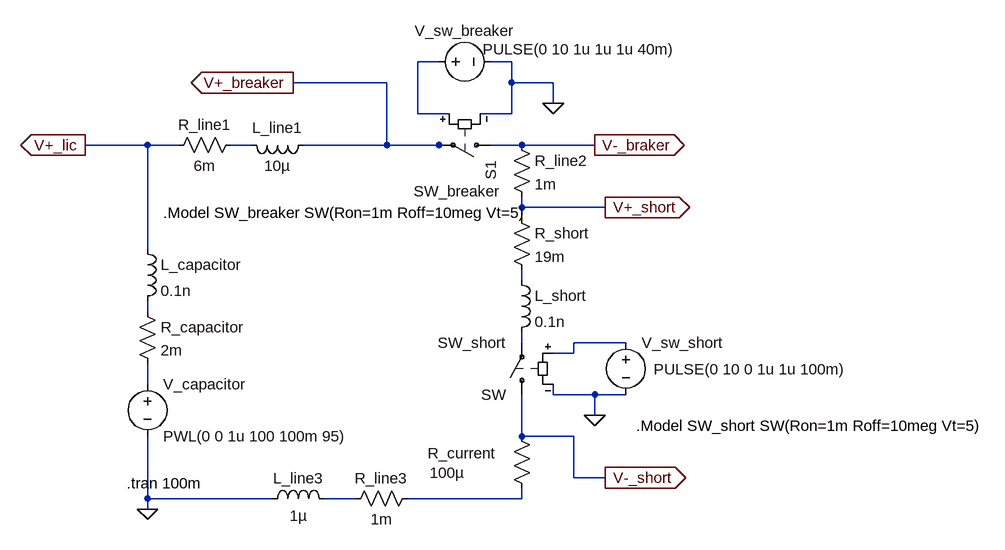
[diagram p0: schematic external-short-circuit-test_v1.asc]
external-short-circuit-test_v1.asc, the LTspice schematic file:
Version 4
SHEET 1 1392 680
WIRE 528 -240 496 -240
WIRE 640 -240 608 -240
WIRE 448 -208 304 -208
WIRE 640 -208 640 -240
WIRE 704 -208 640 -208
WIRE 704 -176 704 -208
WIRE 496 -160 496 -240
WIRE 544 -160 496 -160
WIRE 640 -160 640 -208
WIRE 640 -160 592 -160
WIRE 80 -112 -16 -112
WIRE 128 -112 80 -112
WIRE 240 -112 208 -112
WIRE 448 -112 448 -208
WIRE 448 -112 320 -112
WIRE 528 -112 448 -112
WIRE 544 -112 528 -112
WIRE 656 -112 608 -112
WIRE 768 -112 656 -112
WIRE 656 -16 656 -32
WIRE 784 -16 656 -16
WIRE 656 0 656 -16
WIRE 80 48 80 -112
WIRE 656 96 656 80
WIRE 80 144 80 128
WIRE 656 192 656 176
WIRE 816 192 736 192
WIRE 736 208 736 192
WIRE 736 208 704 208
WIRE 80 256 80 224
WIRE 704 272 704 256
WIRE 768 272 704 272
WIRE 816 272 768 272
WIRE 768 304 768 272
WIRE 656 336 656 272
WIRE 736 336 656 336
WIRE 736 400 736 336
WIRE 784 400 736 400
WIRE 80 432 80 336
WIRE 272 432 80 432
WIRE 400 432 352 432
WIRE 656 432 656 416
WIRE 656 432 480 432
WIRE 80 448 80 432
FLAG 80 448 0
FLAG 768 304 0
FLAG -16 -112 V+_lic
IOPIN -16 -112 Out
FLAG 784 -16 V+_short
IOPIN 784 -16 Out
FLAG 304 -208 V+_breaker
IOPIN 304 -208 Out
FLAG 768 -112 V-_braker
IOPIN 768 -112 Out
FLAG 784 400 V-_short
IOPIN 784 400 Out
FLAG 704 -176 0
SYMBOL res 64 128 R0
SYMATTR InstName R_capacitor
SYMATTR Value 2m
SYMBOL ind 64 32 R0
SYMATTR InstName L_capacitor
SYMATTR Value 0.1n
SYMBOL res 224 -128 R90
WINDOW 0 0 56 VBottom 2
WINDOW 3 32 56 VTop 2
SYMATTR InstName R_line1
SYMATTR Value 6m
SYMBOL ind 336 -128 R90
WINDOW 0 5 56 VBottom 2
WINDOW 3 32 56 VTop 2
SYMATTR InstName L_line1
SYMATTR Value 10µ
SYMBOL res 640 -128 R0
SYMATTR InstName R_line2
SYMATTR Value 1m
SYMBOL res 640 -16 R0
SYMATTR InstName R_short
SYMATTR Value 19m
SYMBOL ind 640 80 R0
SYMATTR InstName L_short
SYMATTR Value 0.1n
SYMBOL res 640 320 R0
WINDOW 0 -129 42 Left 2
WINDOW 3 -126 72 Left 2
SYMATTR InstName R_current
SYMATTR Value 100µ
SYMBOL voltage 80 240 R0
WINDOW 123 0 0 Left 0
WINDOW 39 0 0 Left 0
SYMATTR InstName V_capacitor
SYMATTR Value PWL(0 0 1u 100 100m 95)
SYMBOL voltage 816 176 R0
WINDOW 3 43 57 Left 2
WINDOW 123 0 0 Left 0
WINDOW 39 0 0 Left 0
SYMATTR Value PULSE(0 10 0 1u 1u 100m)
SYMATTR InstName V_sw_short
SYMBOL sw 656 288 R180
SYMATTR InstName SW
SYMATTR Value SW_short
SYMBOL sw 624 -112 R90
WINDOW 3 71 0 VRight 2
SYMATTR Value SW_breaker
SYMATTR InstName S1
SYMBOL voltage 512 -240 R270
WINDOW 0 32 56 VTop 2
WINDOW 3 35 232 VBottom 2
WINDOW 123 0 0 Left 0
WINDOW 39 0 0 Left 0
SYMATTR InstName V_sw_breaker
SYMATTR Value PULSE(0 10 1u 1u 1u 40m)
SYMBOL res 496 416 R90
WINDOW 0 0 56 VBottom 2
WINDOW 3 32 56 VTop 2
SYMATTR InstName R_line3
SYMATTR Value 1m
SYMBOL ind 256 448 R270
WINDOW 0 32 56 VTop 2
WINDOW 3 5 56 VBottom 2
SYMATTR InstName L_line3
SYMATTR Value 1µ
TEXT 48 408 Left 2 !.tran 100m
TEXT 832 320 Left 2 !.Model SW_short SW(Ron=1m Roff=10meg Vt=5)
TEXT 104 -8 Left 2 !.Model SW_breaker SW(Ron=1m Roff=10meg Vt=5)

The netlist it stands for:
* external-short-circuit-test_v1.asc
R_capacitor N004 N007 2m
L_capacitor V+_lic N004 0.1n
R_line1 N002 V+_lic 6m
L_line1 V+_breaker N002 10µ
R_line2 V-_braker V+_short 1m
R_short V+_short N003 19m
L_short N003 N005 0.1n
R_current V-_short N009 100µ
V_capacitor N007 0 PWL(0 0 1u 100 100m 95)
V_sw_short N006 0 PULSE(0 10 0 1u 1u 100m)
SW V-_short N005 N006 0 SW_short
S1 V-_braker V+_breaker N001 0 SW_breaker
V_sw_breaker N001 0 PULSE(0 10 1u 1u 1u 40m)
R_line3 N009 N008 1m
L_line3 0 N008 1µ
.tran 100m
.Model SW_short SW(Ron=1m Roff=10meg Vt=5)
.Model SW_breaker SW(Ron=1m Roff=10meg Vt=5)
.backanno
.end